# Altium schematic sheet Sensors.SchDoc: Sensors
size A3; SheetNumber: 7
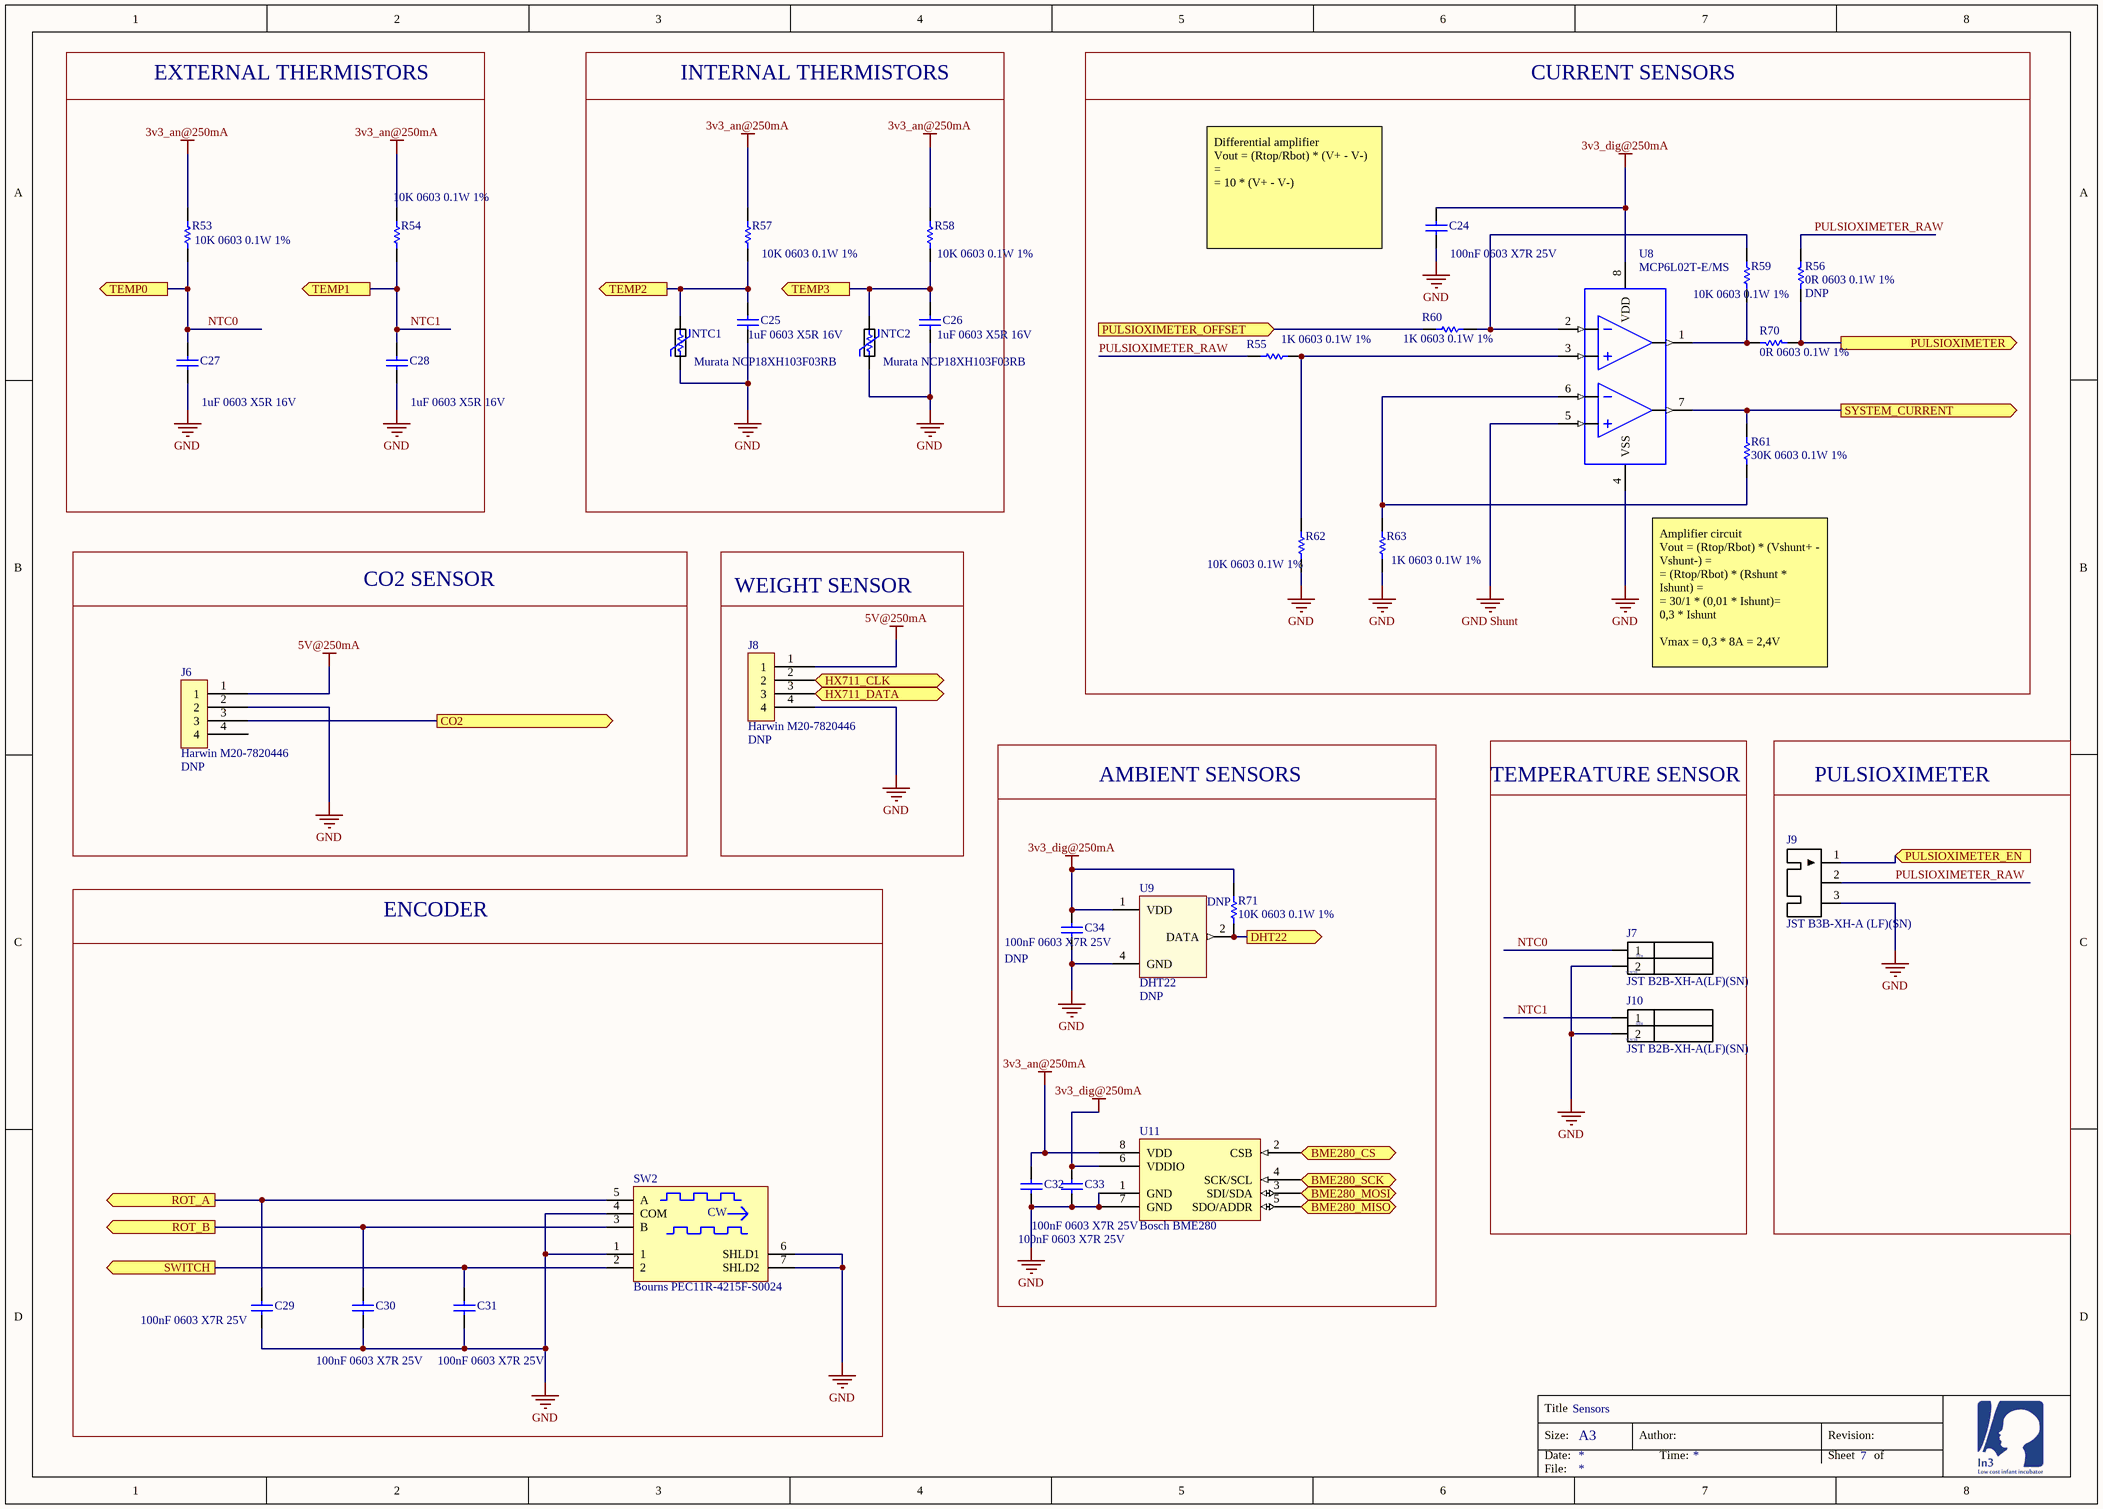
[diagram p0: Sensors.SchDoc]

## Parts
C24  100nF 0603 X7R 25V  [CAPC1608X60X35NL10T15]
C25  1uF 0603 X5R 16V  [CAPC1608X60X35NL10T15]
C26  1uF 0603 X5R 16V  [CAPC1608X60X35NL10T15]
C27  1uF 0603 X5R 16V  [CAPC1608X60X35NL10T15]
C28  1uF 0603 X5R 16V  [CAPC1608X60X35NL10T15]
C29  100nF 0603 X7R 25V  [CAPC1608X60X35NL10T15]
C30  100nF 0603 X7R 25V  [CAPC1608X60X35NL10T15]
C31  100nF 0603 X7R 25V  [CAPC1608X60X35NL10T15]
C32  100nF 0603 X7R 25V  [CAPC1608X60X35NL10T15]
C33  100nF 0603 X7R 25V  [CAPC1608X60X35NL10T15]
C34  100nF 0603 X7R 25V  [CAPC1608X60X35NL10T15]  (no BOM)
J6  Harwin M20-7820446  [PCB-tt6oa92k1i3euqam155k-1]  (no BOM)
J7  JST B2B-XH-A(LF)(SN)  [PCB-fq0z2oxaey6bitejv126-1]
J8  Harwin M20-7820446  [PCB-tt6oa92k1i3euqam155k-1]  (no BOM)
J9  JST B3B-XH-A (LF)(SN)  [PCB-sw29re0t3wmdwksqqhzo-1]
J10  JST B2B-XH-A(LF)(SN)  [PCB-fq0z2oxaey6bitejv126-1]
NTC1  Murata NCP18XH103F03RB  [RESC1609X55X30ML10T20]
NTC2  Murata NCP18XH103F03RB  [RESC1609X55X30ML10T20]
R53  10K 0603 0.1W 1%  [RESC1609X55X30ML10T20]
R54  10K 0603 0.1W 1%  [RESC1609X55X30ML10T20]
R55  1K 0603 0.1W 1%  [RESC1609X55X30ML10T20]
R56  0R 0603 0.1W 1%  [RESC1609X55X30ML10T20]  (no BOM)
R57  10K 0603 0.1W 1%  [RESC1609X55X30ML10T20]
R58  10K 0603 0.1W 1%  [RESC1609X55X30ML10T20]
R59  10K 0603 0.1W 1%  [RESC1609X55X30ML10T20]
R60  1K 0603 0.1W 1%  [RESC1609X55X30ML10T20]
R61  30K 0603 0.1W 1%  [RESC1609X55X30ML10T20]
R62  10K 0603 0.1W 1%  [RESC1609X55X30ML10T20]
R63  1K 0603 0.1W 1%  [RESC1609X55X30ML10T20]
R70  0R 0603 0.1W 1%  [RESC1609X55X30ML10T20]
R71  10K 0603 0.1W 1%  [RESC1609X55X30ML10T20]  (no BOM)
SW2  Bourns PEC11R-4215F-S0024  [BOUR-PEC11R-4XXXF-SXXXX_V]
U8  MCP6L02T-E/MS  [PCB-e8n0jpjj0ctkgxf737qv-1]
U9  DHT22  [DHT22]  (no BOM)
U11  Bosch BME280  [LGA-8]

## Blocks framed on the sheet
EXTERNAL THERMISTORS: C27 C28 R53 R54
INTERNAL THERMISTORS: C25 C26 NTC1 NTC2 R57 R58
CURRENT SENSORS: C24 R55 R56 R59-R63 R70 U8
CO2 SENSOR: J6
WEIGHT SENSOR: J8
AMBIENT SENSORS: C32-C34 R71 U9 U11
TEMPERATURE SENSOR: J7 J10
PULSIOXIMETER: J9
ENCODER: C29-C31 SW2

## Ports
BME280_CS (in), BME280_MISO, BME280_MOSI (in), BME280_SCK (in), CO2 (out), DHT22 (out), HX711_CLK (in), HX711_DATA (bidir), PULSIOXIMETER (out), PULSIOXIMETER_EN (in), PULSIOXIMETER_OFFSET (in), ROT_A (out), ROT_B (out), SWITCH (out), SYSTEM_CURRENT (out), TEMP0 (out), TEMP1 (out), TEMP2 (out), TEMP3 (out)

## Nets
3v3_an@250mA: C32.2 R53.2 R54.2 R57.2 R58.2 U11.8(VDD)
3v3_dig@250mA: C24.2 C33.2 C34.2 R71.1 U8.8(VDD) U9.1(VDD) U11.6(VDDIO)
5V@250mA: J6.1 J8.1
GND: C24.1 C25.2 C26.2 C27.2 C28.2 C29.1 C30.1 C31.1 C32.1 C33.1 C34.1 J6.2 J7.2 J8.4 J9.3 J10.2 NTC1.1 NTC2.1 R62.1 R63.1 SW2.1 SW2.4(COM) SW2.6(SHLD1) SW2.7(SHLD2) U8.4(VSS) U9.4(GND) U11.1(GND) U11.7(GND)
GND Shunt: U8.5(VINB+)
BME280_CS: U11.2(CSB) ; port BME280_CS
BME280_MISO: U11.5(SDO/ADDR) ; port BME280_MISO
BME280_MOSI: U11.3(SDI/SDA) ; port BME280_MOSI
BME280_SCK: U11.4(SCK/SCL) ; port BME280_SCK
CO2: J6.3 ; port CO2
DHT22: R71.2 U9.2(DATA) ; port DHT22
HX711_CLK: J8.2 ; port HX711_CLK
HX711_DATA: J8.3 ; port HX711_DATA
NTC0: C27.1 J7.1 R53.1 ; port TEMP0
NTC1: C28.1 J10.1 R54.1 ; port TEMP1
PULSIOXIMETER: R56.1 R70.1 ; port PULSIOXIMETER
PULSIOXIMETER_EN: J9.1 ; port PULSIOXIMETER_EN
PULSIOXIMETER_OFFSET: R60.1 ; port PULSIOXIMETER_OFFSET
PULSIOXIMETER_RAW: J9.2 R55.1 R56.2
ROT_A: C29.2 SW2.5(A) ; port ROT_A
ROT_B: C30.2 SW2.3(B) ; port ROT_B
SWITCH: C31.2 SW2.2 ; port SWITCH
SYSTEM_CURRENT: R61.1 U8.7(OUT_B) ; port SYSTEM_CURRENT
TEMP2: C25.1 NTC1.2 R57.1 ; port TEMP2
TEMP3: C26.1 NTC2.2 R58.1 ; port TEMP3
NetR55_2: R55.2 R62.2 U8.3(VINA+)
NetR59_1: R59.1 R70.2 U8.1(VOUTA)
NetR59_2: R59.2 R60.2 U8.2(VINA-)
NetR61_2: R61.2 R63.2 U8.6(VINB-)

Not connected (* = marked no-connect by the designer): J6 4

## Notes on the sheet
- Differential amplifier
  Vout = (Rtop/Rbot) * (V+ - V-) =
  = 10 * (V+ - V-)
- Amplifier circuit
  Vout = (Rtop/Rbot) * (Vshunt+ - Vshunt-) =
  = (Rtop/Rbot) * (Rshunt * Ishunt) =
  = 30/1 * (0,01 * Ishunt)=
  0,3 * Ishunt
  Vmax = 0,3 * 8A = 2,4V
- Title
- Size:
- Date:
- A3
- Author:
- Time:
- Revision:
- Sheet
- of
- File:
- (in symbol CMP-2317ea6c4d2dfcd0-16) RED; BLACK
- (in symbol CMP-7675167-7) CW

## Library data of the parts
C24 C29-C34 = CMP-c41a0d2b65641bdd-3: package: 0603; capacitance: 100 nF; Dielectric Characteristic: X7R
  C34: DNP: DNP
C25-C28 = CMP-119984-2: Manufacturer Part Number: GRM185R61C105KE44D; Capacitance Tolerance: ±10%; Case/Package (in): 0603; Lead-Free Status: Lead Free; Capacitance: 1uF; Dielectric Characteristic: X5R; Lifecycle Status: Active; Mounting Style: Surface Mount; Number of Pins: 2; Octopart Url: https://octopart.com/grm185r61c105ke44d-murata-197446; OctopartID: de3e1737f81e01f9; REACH SVHC Compliance: No SVHC; RoHS: Compliant; Size-Height: 0.0005 m; Size-Length: 0.0016 m; Size-Thickness: 0.0005 m; Size-Width: 0.0008 m; Rated voltage: 16V
J6 J8 = CMP-2481958-5: Conn Socket Strip SKT 4 POS 2.54mm Solder ST Thru-Hole Tube; Number of Contacts: 4; Current Rating: 3.00 A; Insulation Resistance: 1.00 MΩ; Number of Mating Cycles: 50; Gender: Female; Contact Resistance: 15.0 mΩ; Contact Material: Phosphor Bronze; Number of Rows: 1; OctopartID: 0d9ac4c1d3c6d25d; Pin Pitch: 2.54 mm; Octopart URL: http://octopart.com/m20-7820446-harwin-5372730; RoHS: Compliant; REACH SVHC Compliance: No SVHC; Contact Plating: Tin; Mounting Style: Through Hole, Vertical; Manufacturer Part Number: M20-7820446; DNP: DNP
J7 J10 = CMP-2317ea6c4d2dfcd0-16: XH Series 2 Position 2.5 mm Pitch Through Hole Top Entry Shrouded Header; Number of Contacts: 2; Current Rating: 3.00 A; Voltage Rating (AC): 250 V; Contact Resistance: 10.0 mΩ; Lead-Free Status: Lead Free; Insulation Resistance: 1.00 GΩ; Gender: Male; Manufacturer Part Number: B2B-XH-A(LF)(SN); Octopart URL: https://octopart.com/b2b-xh-a%28lf%29%28sn%29-jst-7424860; OctopartID: 2317ea6c4d2dfcd0; REACH SVHC Compliance: No SVHC; Mounting Style: Through Hole, Vertical; Operating Temperature: -25.0 °C (min); Contact Plating: Tin, Tin Lead; RoHS: Compliant; Contact Material: Brass
J9 = CMP-56379f4f046d89f0-13: XH Series 3 Position 2.5 mm Pitch Through Hole Crimp Top Entry Shrouded Header
NTC1 NTC2 = CMP-2153918-5: Thermistor NTC 10K Ohm 1% 2-Pin 0603 Surface Mount Solder Pad 3434K T/R; Current Rating: 310 uA; Lead-Free Status: Lead Free; OctopartID: 9ea857a9d959416f; Number of Pins: 2; Packaging: Reel; REACH SVHC Compliance: No SVHC; Octopart URL: http://octopart.com/ncp18xh103f03rb-murata-746135; RoHS: Compliant; Mounting Style: Surface Mount; Resistance: 10k; Manufacturer Part Number: NCP18XH103F03RB; Tolerance: 1%; package: 0603
R53 R54 R57-R59 R62 R71 = CMP-4716590-9: Octopart Url: https://octopart.com/crcw060310k0fkeahp-vishay-42634028; package: 0603; Resistance: 10k; Tolerance: 1%
  R71: DNP: DNP
R55 R60 R63 = CMP-a61f6f36030f79d8-4: Manufacturer Part Number: CR0603-FX-1001ELF; Power Rating: 100 mW; Case/Package (SI): 1608; Voltage Rating (DC): 50.0 V; Temperature Coefficient: -100 ppm/°C to 100 ppm/°C; REACH SVHC Compliance: No SVHC; Packaging: Tape & Reel (TR), Cut Tape (CT); Resistance Tolerance: ±1%; Resistance: 1k; RoHS: Compliant; Mounting Style: Surface Mount; Number of Pins: 2; Size-Length: 1.60 mm; Octopart URL: https://octopart.com/cr0603-fx-1001elf-bourns-2326646; Size-Thickness: 457 µm; OctopartID: a61f6f36030f79d8; Size-Width: 787 µm; Case/Package: 0603
R56 R70 = CMP-536b9a7387ce8cac-10: HelpURL: http://www.yageo.com/documents/recent/PYu-RC_Group_51_RoHS_L_9.pdf; Resistance: 0R; package: 0603; DNP: DNP
R61 = CMP-3655986-6: Resistance: 30k; Tolerance: 1%; package: 0603
SW2 = CMP-7675167-7: 12 mm Incremental Encoder, 24 Detent, -30 to 70 degC, 5-Pin THD, RoHS, Bulk; Number of Detents: 24; Size-Length: 13.4 mm; Seller Landing  Url: https://octopart.com/click/track?country=US&ak=8157f166&sig=0be53b6&sid=1106&ppid=26648293&vpid=76310724&ct=offers; Manufacturer Part Number: PEC11R-4215F-S0024; ComponentLink2Description: Datasheet; Octopart Url: http://octopart.com/pec11r-4215f-s0024-bourns-26648293; ComponentLink1URL: http://www.bourns.com/; RoHS: Compliant; ComponentLink1Description: Manufacturer URL; PackageReference: PEC11R-4XXXF-SXXXX; PackageDescription: 5-Pin Through Hole Device, Body 12.5 x 13.4 mm; Size-Width: 12.5 mm; OctopartID: f33f3ba348bc2cf8; DatasheetVersion: Jul-14; ComponentLink2URL: http://www.bourns.com/docs/Product-Datasheets/PEC11R.pdf; REACH SVHC Compliance: No SVHC
U8 = CMP-1319549-4: Microchip MCP6L02T-E/MS, Dual Op Amp, 1MHz Rail-Rail, 1.8 to 6 V, 8-Pin MSOP
U9 = CMP-ab3a63ff523b74fd-4: Micrometer Head for Small Items, Opens to 1/2", Compatible with all 300 Series Bases; Manufacturer Part Number: 385; Lead-Free Status: Lead Free; Octopart URL: http://octopart.com/385-adafruit+industries-30399591; Size-Length: 15.9 mm; Packaging: Bulk; RoHS: Not Applicable; OctopartID: ab3a63ff523b74fd; DNP: DNP
U11 = CMP-19345792-12: Combined humidity and pressure sensor; Lead-Free Status: Lead Free; RoHS: Compliant; OctopartID: a1c26bef29297e05; Octopart Url: https://octopart.com/bme280-bosch-52931981; Manufacturer Part Number: BME280